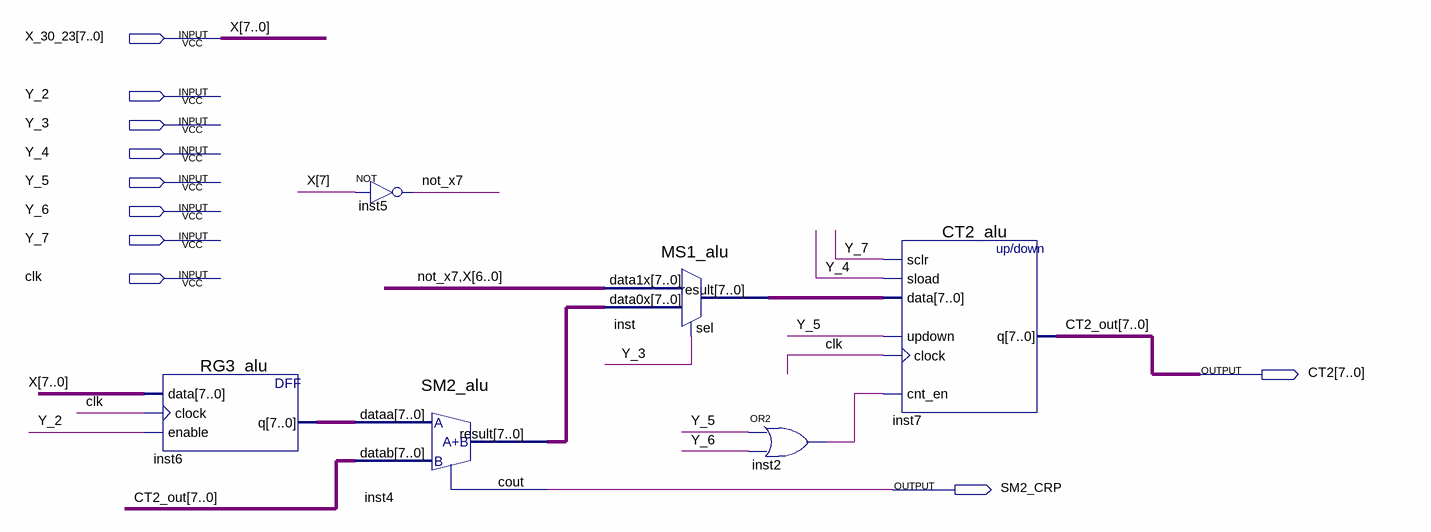
[diagram p0: schematic sheet]
// Quartus schematic RG3_SM2_MS1_CT2_block.bdf as structural Verilog: 6 symbols, 10 pins
module RG3_SM2_MS1_CT2_block (
  input  [7:0] X_30_23,
  input  Y_2,
  input  Y_3,
  input  Y_4,
  input  Y_5,
  input  Y_6,
  input  Y_7,
  input  clk,
  output [7:0] CT2,
  output SM2_CRP
);

  wire inst2_out, not_x7;
  wire [7:0] inst4_result, inst6_q, inst_result;

  RG3_alu inst6 (.data(X_30_23), .clock(clk), .enable(Y_2), .q(inst6_q));
  not inst5 (not_x7, X_30_23[7]);
  SM2_alu inst4 (.dataa(inst6_q), .datab(CT2), .result(inst4_result), .cout(SM2_CRP));
  MS1_alu inst (.data1x({not_x7, X_30_23[6:0]}), .data0x(inst4_result), .sel(Y_3), .result(inst_result));
  or inst2 (inst2_out, Y_5, Y_6);
  CT2_alu inst7 (.sclr(Y_7), .sload(Y_4), .data(inst_result), .updown(Y_5), .clock(clk), .cnt_en(inst2_out), .q(CT2));

  // Other names for the same wires on the sheet: CT2_out[7:0] = CT2; X[7:0] = X_30_23
endmodule
